# Altium project LT3470.PrjPCB
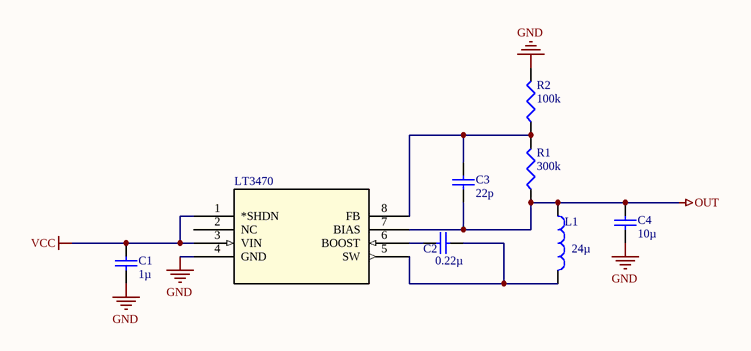
[diagram p0: LT3470.SchDoc]
1 sheet, 8 parts. Net scope: global (net labels, ports and power ports of the same name join across sheets).

## Sheet LT3470.SchDoc
size A4

### Parts
C1  value 1µ  [CAPR2.54-5.1x3.2]  (hidden comment: Condensateur)
C2  value 0.22µ  [CAPR2.54-5.1x3.2]  (hidden comment: Condensateur)
C3  value 22p  [CAPR2.54-5.1x3.2]  (hidden comment: Condensateur)
C4  value 10µ  [CAPR2.54-5.1x3.2]  (hidden comment: Condensateur)
L1  value 24µ  [AXIAL-0.5]  (hidden comment: Inductance)
LT3470  Part Number: LT3470ITS8  [TSOT-23_TS8]  (value not drawn)
R1  value 300k  [AXIAL-0.4]  (hidden comment: Résistance)
R2  value 100k  [AXIAL-0.4]  (hidden comment: Résistance)

### Nets
GND: C1.2 C4.2 LT3470.4(GND) R2.2
OUT: C3.1 C4.1 L1.1 LT3470.7(BIAS) R1.1
VCC: C1.1 LT3470.1(*SHDN) LT3470.3(VIN)
NetC2_1: C2.1 LT3470.6(BOOST)
NetC2_2: C2.2 L1.2 LT3470.5(SW)
NetC3_2: C3.2 LT3470.8(FB) R1.2 R2.1

Not connected (* = marked no-connect by the designer): LT3470 2(NC)

### Library data of the parts
LT3470 = LT3470ITS8: No Description Available; Vendor: Linear Technology; Manufacturer_Part_Number: LT3470ITS8; Copyright: Copyright (C) 2018 Accelerated Designs. All rights reserved; RefDes: RefDes; Type: DEV; Value: Value
R1 R2 = Résistance: Résistance standard; Designer: ECAM 2005; Type: Résistance standard
C1-C4 = Condensateur: Supplier: Farnell; Designer: ECAM 2004
L1 = Inductance: Designer: ECAM 2003